# Altium schematic sheet Voice.SchDoc
size A4
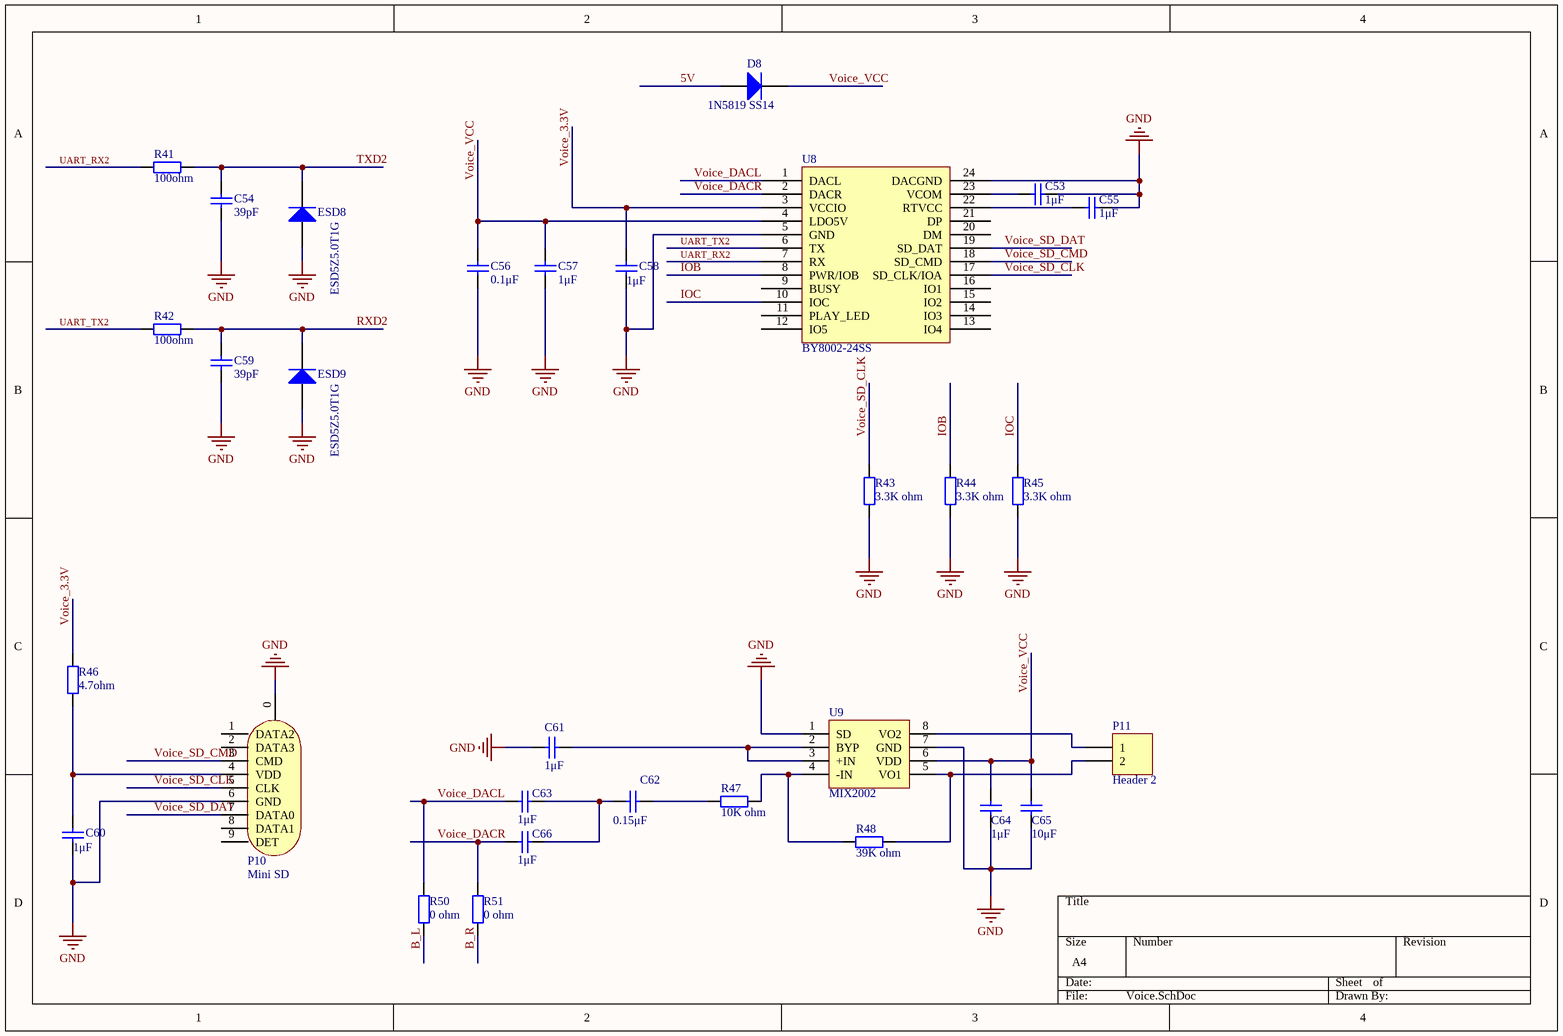
[diagram p0: Voice.SchDoc]

## Parts
C53  1μF  [0603C]
C54  39pF  [0603C]
C55  1μF  [0603C]
C56  0.1μF  [0603C]
C57  1μF  [0603C]
C58  1μF  [0603C]
C59  39pF  [0603C]
C60  1μF  [0603C]
C61  1μF  [0603C]
C62  0.15μF  [0603C]
C63  1μF  [0603C]
C64  1μF  [0603C]
C65  10μF  [0603C]
C66  1μF  [0603C]
D8  1N5819 SS14  [SMA-small]
ESD8  ESD5Z5.0T1G  [SOD523]
ESD9  ESD5Z5.0T1G  [SOD523]
P10  Mini SD  [TF-tan]
P11  Header 2  [HDR1X2]
R41  100ohm  [0603R]
R42  100ohm  [0603R]
R43  3.3K ohm  [0603R]
R44  3.3K ohm  [0603R]
R45  3.3K ohm  [0603R]
R46  4.7ohm  [0603R]
R47  10K ohm  [0603R]
R48  39K ohm  [0603R]
R50  0 ohm  [0603R]
R51  0 ohm  [0603R]
U8  BY8002-24SS  [QSOP-24N]
U9  MIX2002  [SOP8 - NO-HP]

## Nets
GND: C53.1 C54.1 C55.1 C56.1 C57.1 C58.1 C59.1 C60.1 C61.1 C64.1 C65.1 ESD8.1(A) ESD9.1(A) P10.0 P10.6(GND) R43.1 R44.1 R45.1 U8.5(GND) U8.24(DACGND) U9.1(SD) U9.7(GND)
5V: D8.1(A)
B_L: R50.1
B_R: R51.1
IOB: R44.2 U8.8(PWR/IOB)
IOC: R45.2 U8.10(IOC)
RXD2: C59.2 ESD9.2(K) R42.2
TXD2: C54.2 ESD8.2(K) R41.2
UART_RX2: R41.1 U8.7(RX)
UART_TX2: R42.1 U8.6(TX)
Voice_3.3V: C58.2 R46.2 U8.3(VCCIO)
Voice_DACL: C63.1 R50.2 U8.1(DACL)
Voice_DACR: C66.1 R51.2 U8.2(DACR)
Voice_SD_CLK: P10.5(CLK) R43.2 U8.17(SD_CLK/IOA)
Voice_SD_CMD: P10.3(CMD) U8.18(SD_CMD)
Voice_SD_DAT: P10.7(DATA0) U8.19(SD_DAT)
Voice_VCC: C56.2 C57.2 C64.2 C65.2 D8.2(K) U8.4(LDO5V) U9.6(VDD)
NetC53_2: C53.2 U8.23(VCOM)
NetC55_2: C55.2 U8.22(RTVCC)
NetC60_2: C60.2 P10.4(VDD) R46.1
NetC61_2: C61.2 U9.2(BYP) U9.3(+IN)
NetC62_1: C62.1 C63.2 C66.2
NetC62_2: C62.2 R47.1
NetP11_1: P11.1 U9.8(VO2)
NetP11_2: P11.2 R48.2 U9.5(VO1)
NetR47_2: R47.2 R48.1 U9.4(-IN)

Not connected (* = marked no-connect by the designer): P10 1(DATA2) 2(DATA3) 8(DATA1) 9(DET); U8 9(BUSY) 11(PLAY_LED) 12(IO5) 13(IO4) 14(IO3) 15(IO2) 16(IO1) 20(DM) 21(DP)

## Library data of the parts
C53 C55 C57 C58 C60 C61 C63 C64 C66 = Cap_1μF_50V_0603: 1μF_50V,X5R,±10%; 物料名称: 贴片陶瓷电容; 制造商: muRata; 物料编码: TCC0040; 物料型号: GRM188R61H105KAALD; 单位: PCS; 物料规格: 1μF_50V,X5R,±10%
C54 C59 = Cap_39pF_50V_0603: 39pF_50V,C0G (EIA),±1%; 物料名称: 贴片陶瓷电容; 制造商: muRata; 物料编码: NA; 物料型号: GCM1885C1H390FA16; 单位: PCS; 物料规格: 39pF_50V,C0G (EIA),±1%
C56 = Cap_0.1μF_50V_0603: 0.1μF_50V,X7R,±5%; 物料名称: 贴片陶瓷电容; 制造商: muRata; 物料编码: TCC0087; 物料型号: GRM188R71H104JA93D; 单位: PCS; 物料规格: 0.1μF_50V,X7R,±5%
C62 = Cap_0.15μF_50V_0603: 0.15μF_50V,X7R,±5%; 物料名称: 贴片陶瓷电容; 制造商: muRata; 物料编码: NA; 单位: PCS; 物料规格: 0.15μF_50V,X7R,±5%; 物料型号: NA
C65 = Cap_10μF_35V_0603: 10μF_35V,X5R,20%; 物料规格: 10μF_35V,20%; 物料名称: 贴片陶瓷电容; 制造商: muRata; 物料编码: TCC0071; 物料型号: GRM188R6YA106MA73D; 单位: PCS
D8 = 1N5819 SS14_SMA: 物料名称: 表贴齐纳二极管; 制造商: VISHAY; 物料编码: NA; 单位: PCS; 物料规格: 1N5819 SS14; 物料型号: 1N5819 SS14
ESD8 ESD9 = ESD5Z5.0T1G_SOD523: 物料名称: ESD二极管; 制造商: 安森美; 物料编码: NA; 单位: PCS; 物料规格: ESD5Z5.0T1G; 物料型号: ESD5Z5.0T1G
P10 = Mini SD: 制造商: NA; 物料编码: 深圳; 单位: PCS; 物料规格: Mini SD; 物料名称: Mini SD; 物料型号: Mini SD
P11 = Header 2: Header, 2-Pin; LatestRevisionDate: 17-Jul-2002; LatestRevisionNote: Re-released for DXP Platform.; Publisher: Altium Limited
R41 R42 = Res_100ohm_0603: 100 ohm_5%; 物料名称: 贴片电阻; 制造商: YAGEO; 物料编码: TRS0010; 物料型号: RC0603JR-07100R; 单位: PCS; 物料规格: 100 ohm_5%
R43-R45 = Res_3.3K ohm_0603: 3.3K ohm,1%; 物料名称: 贴片电阻; 制造商: YAGEO; 单位: PCS; 物料规格: 3.3K ohm,1%
R46 = Res_4.7ohm_0603: 4.7ohm,1%; 物料名称: 贴片电阻; 制造商: YAGEO; 物料型号: AA0603FR-074R7L; 单位: PCS; 物料规格: 4.7 ohm,1%
R47 = Res_10K ohm_0603: 10K ohm,1%; 物料名称: 贴片电阻; 制造商: YAGEO; 物料编码: TRS0020; 物料型号: RC0603FR-0710KL; 单位: PCS; 物料规格: 10K ohm,1%
R48 = Res_39K ohm_0603: 39K ohm,1%; 物料名称: 贴片电阻; 制造商: YAGEO; 物料编码: NA; 物料型号: RC0603FR-0739KL; 单位: PCS; 物料规格: 39K ohm,1%
R50 R51 = Res_0 ohm_0603: 0 ohm,5%; 物料名称: 贴片电阻; 制造商: YAGEO; 物料编码: TRS0003; 物料型号: RC0603JR-070RL; 单位: PCS; 物料规格: 0 ohm,5%
U8 = BY8002-24SS: 物料名称: 音频播放芯片; 制造商: 深圳市百为电子科技有限公司; 物料编码: NA; 单位: PCS; 物料规格: BY8002-24SS; 物料型号: BY8002-24SS
U9 = MIX2002: 物料名称: 2.5W功放; 制造商: Mixinno; 物料编码: NA; 单位: PCS; 物料规格: MIX2002; 物料型号: MIX2002